# EAGLE schematic INPUT OUTPUT (EAGLE 9.6.2)
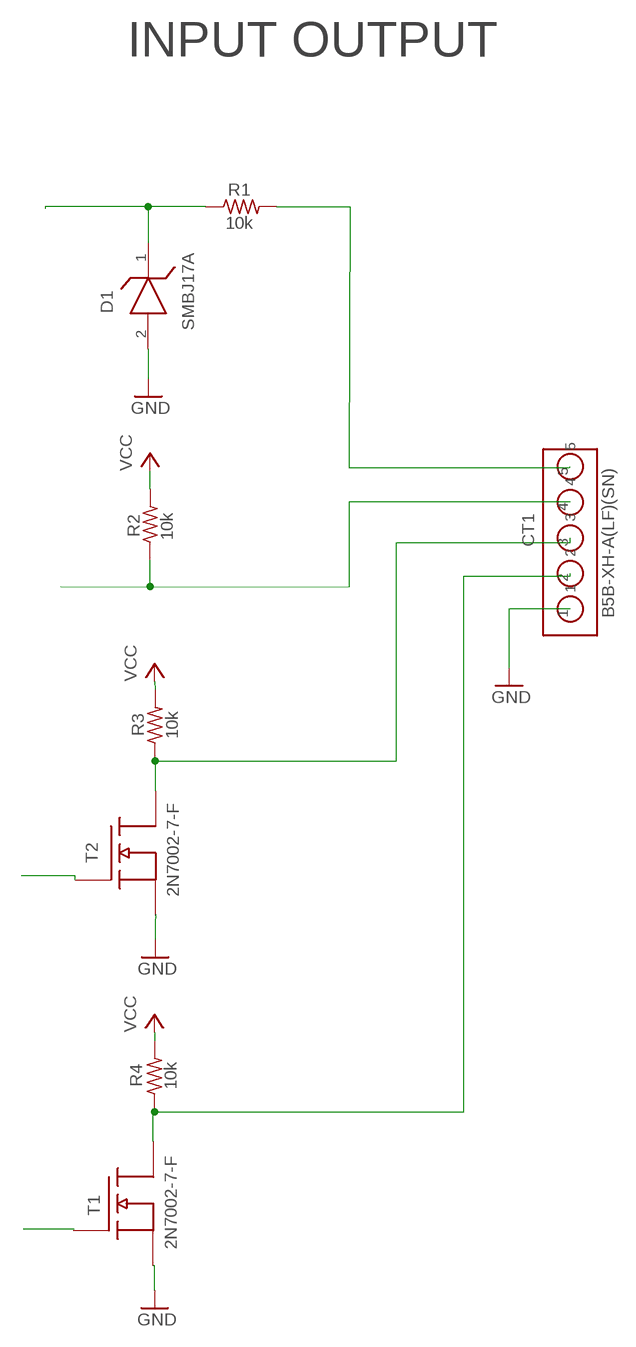
[diagram p0: schematic, sheet 1]

## Parts
CT1  B5B-XH-A(LF)(SN)  [5-PIN-JST]
D1  SMBJ17A  [DO-214AA]
R1  10k  R-US_R0805  [R0805]
R2  10k  R-US_R0805  [R0805]
R3  10k  R-US_R0805  [R0805]
R4  10k  R-US_R0805  [R0805]
T1  2N7002-7-F  [TO-236-3]
T2  2N7002-7-F  [TO-236-3]

## Nets
GND: CT1.1 D1.2(A) T1.S(SOURCE)
N$1: CT1.3 R3.1 T2.D(DRAIN)
N$2: CT1.2 R4.1 T1.D(DRAIN)
N$4: T2.G(GATE)
N$5: CT1.4
N$6: CT1.5 R1.2
N$7: D1.1(C) R1.1
N$8: R2.1
VCC: R2.2 R3.2 R4.2
Unconnected: T1.G(GATE) T2.S(SOURCE)

## Notes on the sheet
- INPUT OUTPUT

## Library data of the parts
CT1 = B5B-XH-A(LF)(SN)-JST:B5B-XH-A(LF)(SN); PARTNO: B5B-XH-A(LF)(SN)
D1 = SMBJ17A:SMBJ17A; PART_NO: SMBJ17A
R1-R4 = rcl:R-US_: RESISTOR, American symbol; PARTNO: Y40227K34000T9W; SPICEPREFIX: R
T1 T2 = nacha_weaitas:2N7002-7-F; PART_NO: 2N7002-7-F